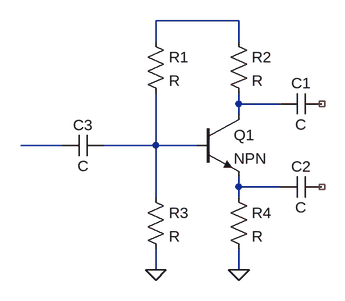
[diagram p0: schematic Draft1.asc]
Draft1.asc, the LTspice schematic file:
Version 4
SHEET 1 880 680
WIRE 240 -80 112 -80
WIRE 112 -48 112 -80
WIRE 240 -48 240 -80
WIRE 240 48 240 32
WIRE 304 48 240 48
WIRE 240 64 240 48
WIRE -32 112 -96 112
WIRE 112 112 112 32
WIRE 112 112 32 112
WIRE 176 112 112 112
WIRE 240 176 240 160
WIRE 304 176 240 176
WIRE 112 192 112 112
WIRE 240 192 240 176
WIRE 112 304 112 272
WIRE 240 304 240 272
FLAG 112 304 0
FLAG 240 304 0
SYMBOL res 96 -64 R0
SYMATTR InstName R1
SYMBOL res 224 -64 R0
SYMATTR InstName R2
SYMBOL res 96 176 R0
SYMATTR InstName R3
SYMBOL res 224 176 R0
SYMATTR InstName R4
SYMBOL npn 176 64 R0
SYMATTR InstName Q1
SYMBOL cap 368 32 R90
WINDOW 0 0 32 VBottom 2
WINDOW 3 32 32 VTop 2
SYMATTR InstName C1
SYMBOL cap 368 160 R90
WINDOW 0 0 32 VBottom 2
WINDOW 3 32 32 VTop 2
SYMATTR InstName C2
SYMBOL cap 32 96 R90
WINDOW 0 0 32 VBottom 2
WINDOW 3 32 32 VTop 2
SYMATTR InstName C3

The netlist it stands for:
* Draft1.asc
R1 N001 N004 R
R2 N001 N002 R
R3 N004 0 R
R4 N005 0 R
Q1 N002 N004 N005 0 NPN
C1 NC_01 N002 C
C2 NC_02 N005 C
C3 N004 N003 C
.model NPN NPN
.model PNP PNP
.lib standard.bjt
.backanno
.end